# EAGLE design OmerFaroukMACHMOUTLAR0098 (EAGLE 9.6.2)
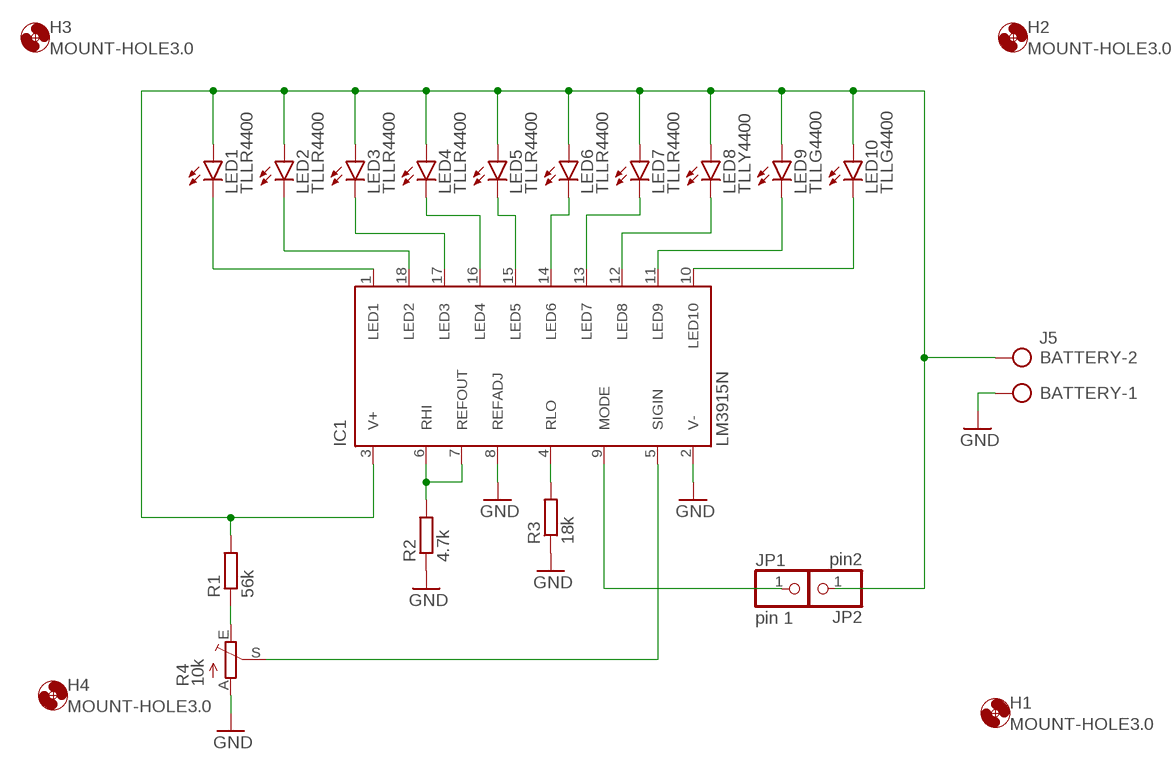
[diagram p0: schematic, sheet 1]

## Parts
BATTERY  J5  AK500/2  [AK500/2]
H1  MOUNT-HOLE3.0  [3,0]
H2  MOUNT-HOLE3.0  [3,0]
H3  MOUNT-HOLE3.0  [3,0]
H4  MOUNT-HOLE3.0  [3,0]
IC1  LM3915N  [DIL18]
JP1  pin 1  PINHD-1X1  [1X01]
JP2  pin2  PINHD-1X1  [1X01]
LED1  TLLR4400  [LED3MM]
LED2  TLLR4400  [LED3MM]
LED3  TLLR4400  [LED3MM]
LED4  TLLR4400  [LED3MM]
LED5  TLLR4400  [LED3MM]
LED6  TLLR4400  [LED3MM]
LED7  TLLR4400  [LED3MM]
LED8  TLLY4400  [LED3MM]
LED9  TLLG4400  [LED3MM]
LED10  TLLG4400  [LED3MM]
R1  56k  R-EU_0204/7  [0204/7]
R2  4.7k  R-EU_0204/7  [0204/7]
R3  18k  R-EU_0204/7  [0204/7]
R4  10k  TRIM_EU-S64W  [S64W]

## Nets
GND: BATTERY.1 IC1.2(V-) IC1.8(REFADJ) R2.1 R3.1 R4.A
N$1: IC1.15(LED5) LED5.K(C)
N$2: IC1.14(LED6) LED6.K(C)
N$3: IC1.16(LED4) LED4.K(C)
N$4: IC1.13(LED7) LED7.K(C)
N$5: IC1.17(LED3) LED3.K(C)
N$6: IC1.1(LED1) LED1.K(C)
N$7: IC1.12(LED8) LED8.K(C)
N$8: IC1.18(LED2) LED2.K(C)
N$9: IC1.11(LED9) LED9.K(C)
N$10: IC1.10(LED10) LED10.K(C)
N$11: IC1.6(RHI) IC1.7(REFOUT) R2.2
N$12: IC1.4(RLO) R3.2
N$13: BATTERY.2 IC1.3(V+) JP2.1 LED1.A LED2.A LED3.A LED4.A LED5.A LED6.A LED7.A LED8.A LED9.A LED10.A R1.2
N$14: IC1.9(MODE) JP1.1
N$15: IC1.5(SIGIN) R4.S
N$16: R1.1 R4.E

## Library data of the parts
BATTERY = con-ptr500:AK500/2: CONNECTOR; OC_FARNELL: unknown; OC_NEWARK: unknown
H1-H4 = holes:MOUNT-HOLE: MOUNTING HOLE with drill center marker
IC1 = national-semiconductor:LM391: Dot/Bar Display Driver Source: Data sheet LM3915 <http://www.national.com/ds/LM/LM3915.pdf> Data sheet LM3914 <http://www.national.com/ds/LM/LM3914.pdf>
JP1 JP2 = pinhead:PINHD-1X1: PIN HEADER
LED1-LED7 = led:TLLR4400: Low Current (2mA) LED 3 mm Tinted Diffused Package color RED Source: Data sheet <http://www.farnell.com/datasheets/391100.pdf>; MF: VISHAY SEMICONDUCTOR; OC_FARNELL: 1612437
LED8 = led:TLLY4400: Low Current (2mA) LED 3 mm Tinted Diffused Package color YELLOW Source: Data sheet <http://www.farnell.com/datasheets/391098.pdf>; MF: VISHAY SEMICONDUCTOR; OC_FARNELL: 1612439
LED9 LED10 = led:TLLG4400: Low Current (2mA) LED 3 mm Tinted Diffused Package color GREEN Source: Data sheet <http://www.farnell.com/datasheets/391098.pdf>; MF: VISHAY SEMICONDUCTOR; OC_FARNELL: 1612435
R1-R3 = rcl:R-EU_: RESISTOR, European symbol; SPICEPREFIX: R
R4 = pot:TRIM_EU-: POTENTIOMETER

## Board
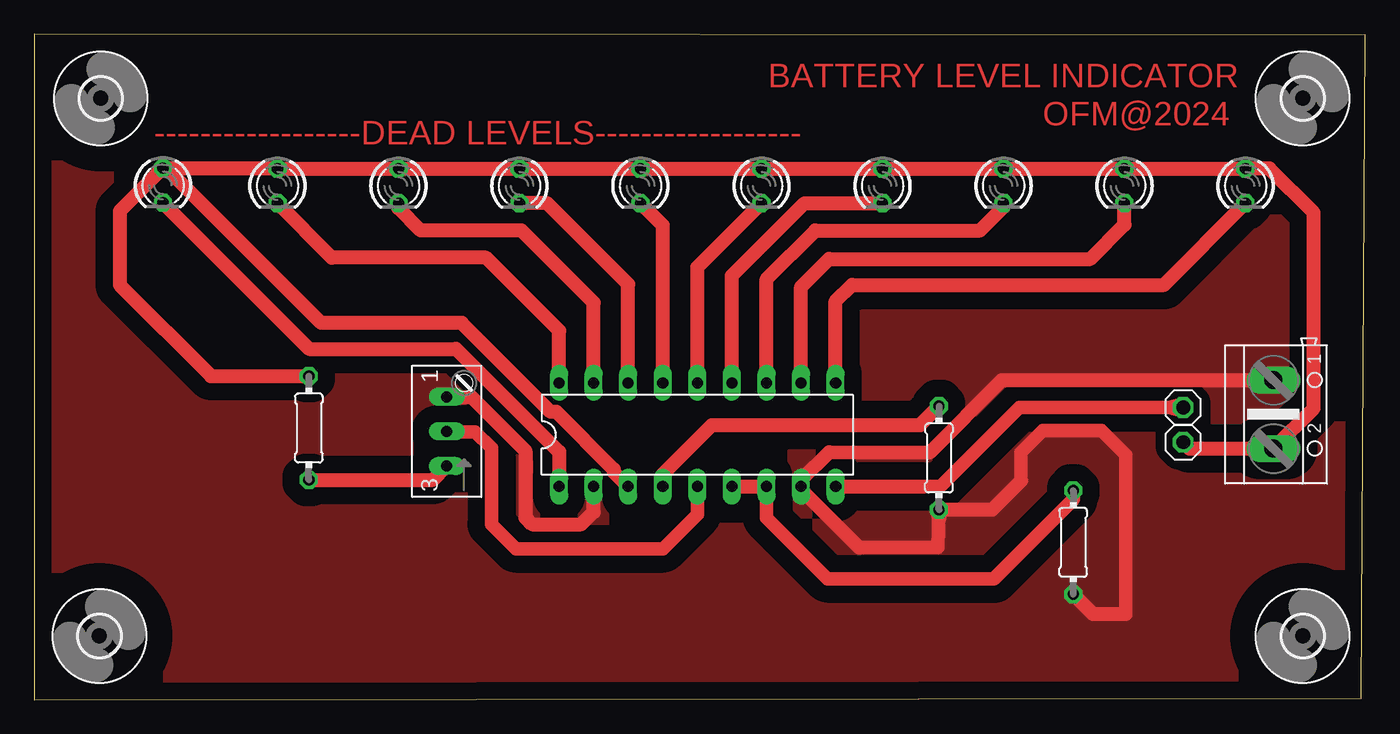
[diagram p1: board, top side]

Size 97.81 x 48.93 mm. Coordinates in mm from the lower left corner, seen from the top.
Outline: 0,0 97.51,0.1 97.81,48.83 0,48.93 0,0
Copper layers (1*16): Top 0.035mm / dielectric 1.5mm / Bottom 0.035mm
Design rules "default *": minimum track width 20mil, minimum drill 0.8mm, track to track 12mil, track to pad 12mil, pad to pad 12mil, via to via 12mil, smd to smd 12mil, copper to edge 40mil, drill to drill 40mil, minimum pad ring 10mil, minimum via ring 8mil, stop-mask expansion 4mil, vias tented up to drill 0mil, thermal gap 10mil

### Footprints (pad centres in the part's own frame; a part is rotated, then mirrored left to right if it is on the bottom)
AK500/2 = drill 1.321 long: 1 -2.515,0; 2 2.515,0
3,0 = hole 3: 0,0
DIL18 = drill 0.813 long: 1 -10.16,-3.81; 2 -7.62,-3.81; 3 -5.08,-3.81; 4 -2.54,-3.81; 5 0,-3.81; 6 2.54,-3.81; 7 5.08,-3.81; 8 7.62,-3.81; 9 10.16,-3.81; 10 10.16,3.81; 11 7.62,3.81; 12 5.08,3.81; 13 2.54,3.81; 14 0,3.81; 15 -2.54,3.81; 16 -5.08,3.81; 17 -7.62,3.81; 18 -10.16,3.81
1X01 = drill 1.016 octagon: 1 0,0
LED3MM = drill 0.813 octagon: A -1.27,0; K 1.27,0
0204/7 = drill 0.813 octagon: 1 -3.81,0; 2 3.81,0
S64W = drill 0.813 long: A 2.54,1.27; E -2.54,1.27; S 0,1.27

### Placement (x,y rotation side)
BATTERY  91.04,20.98 270 top
H1  93.2,44.2 0 top
H2  4.9,44.2 0 top
H3  93.2,4.7 0 top
H4  4.8,4.7 0 top
IC1  48.73,19.48 0 top
JP1  84.42,21.49 90 top
JP2  84.42,18.93 90 top
LED1  9.47,37.81 270 top
LED2  17.88,37.77 270 top
LED3  26.77,37.77 270 top
LED4  35.66,37.77 270 top
LED5  44.55,37.77 270 top
LED6  53.44,37.77 270 top
LED7  62.33,37.77 270 top
LED8  71.22,37.77 270 top
LED9  80.11,37.77 270 top
LED10  89,37.77 270 top
R1  20.19,19.98 90 top
R2  76.34,11.58 90 top
R3  66.48,17.78 90 top
R4  31.59,19.73 90 top

### Tracks (layer width: path | path; a pad name or v marks a point on that pad's centre or on a via)
GND
  Top 1: 65.8,18.2 58.4,18.2 | R3.1 66.4,11.2 60.6,11.2 | 72.5,16.09 72.5,18.2 74.1,19.8 78.4,19.8 80.2,18 80.2,6.3 | R3.1 66.64,13.93 66.46,13.16 66.32,13.94 R3.1
  Top 1.016: 65.8,18.2 71.09,23.5 BATTERY.1 | 72.5,16.09 70.38,13.97 R3.1 | 80.2,6.3 77.81,6.3 R2.1 | 60.6,11.2 56.35,15.45 IC1.8 56.35,16.15 58.4,18.2 | R4.A 32.13,22.27 36.1,18.3 36.1,13.4 36.6,12.9 40.2,12.9 41.11,13.81 IC1.2
  pour Top (isolate 1.27, no thermals): 0,48.8 0,0 0.1,0.1 97.5,0.1 97.5,49 87.1,49 86.5,48.4 86.5,36.2 85.7,35.4 81.6,31.3 58.8,31.3 58.8,22.5 57,20.7 57,19.3 55.6,17.9 54.7,17 54.6,17 54.6,12.7 54.4,12.5 44.7,12.5 43.1,14.1 8.4,48.8
N$1
  Top 1.02: IC1.15 46.19,34.86 LED5.K
N$2
  Top 1.02: IC1.14 48.73,31.79 LED6.K
N$3
  Top 1.016: IC1.16 43.65,30.55 37.7,36.5 LED4.K
N$4
  Top 1.02: IC1.13 51.27,31.17 56.6,36.5 LED7.K
N$5
  Top 1.016: IC1.17 41.11,29.19 35.8,34.5 28.4,34.5
  Top 1.02: 28.4,34.5 26.77,36.13 LED3.K
N$6
  Top 1.016: LED1.K 20.21,25.8 31,25.8 38.57,18.23 IC1.1
N$7
  Top 1.02: IC1.12 53.81,30.91 57.4,34.5 69.5,34.5 71.22,36.22 LED8.K
N$8
  Top 1.016: IC1.18 38.57,27.13 33.2,32.5 21.88,32.5
  Top 1.02: 21.88,32.5 LED2.K
N$9
  Top 1.016: 58.4,32.4 77.6,32.4 80.11,34.91 LED9.K
  Top 1.02: IC1.11 56.35,30.35 58.4,32.4
N$10
  Top 1.02: IC1.10 58.89,29.29 60.1,30.5 83,30.5 LED10.K
N$11
  Top 1: IC1.7 53.81,13.39 58.3,8.9 70.5,8.9
  Top 1.016: IC1.6 IC1.7 | 70.5,8.9 76.34,14.74 R2.2
N$12
  Top 1.016: IC1.4 46.19,16.59 49.8,20.2 65.09,20.2 R3.2
N$13
  Top 1.016: JP2.1 84.89,18.46 BATTERY.2 94,21.43 94,35.8 90.76,39.04 LED10.A | 6.3,30.5 13.01,23.79 R1.2 | LED1.A 9.72,39.08 21.1,27.7 31.42,27.7 37.96,21.16 38.37,21.16 42.58,16.94 42.58,16.74 IC1.3
  Top 1.02: LED10.A LED9.A LED8.A LED7.A LED6.A LED5.A LED4.A LED3.A LED2.A 17.84,39.08 LED1.A 6.3,35.91 6.3,30.5
N$14
  Top 1: 65.37,15.67 66.57,15.67 72.39,21.49 83.4,21.49 | 83.4,21.49 JP1.1 | 83.4,21.49 84.35,21.24 JP1.1 | 83.4,21.49 84.35,21.74 JP1.1
  Top 1.016: IC1.9 65.37,15.67
N$15
  Top 1: R4.S 30.35,19.7 32.4,19.7 33.6,18.5 33.6,12.9 35.4,11.1 46.2,11.1 48.73,13.63 IC1.5
N$16
  Top 1.016: R1.1 29.3,16.17 R4.E

### Text on the board
Top: BATTERY LEVEL INDICATOR | OFM@2024 | ------------------DEAD LEVELS------------------